# Altium schematic sheet USB.SchDoc
size A4; SheetNumber: 3; SheetTotal: 4
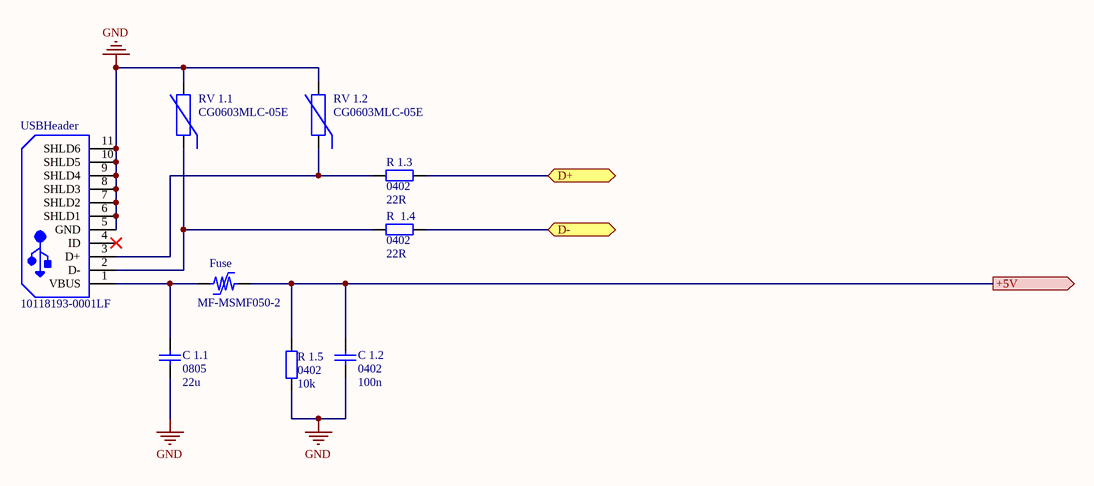
[diagram p0: USB.SchDoc]

## Parts
C_1.1  0805  value 22u  [C0805_M]
C_1.2  0402  value 100n  [C0402_M]
Fuse  MF-MSMF050-2  [BOUR-MF-MSMF050-2_V]
R_1.3  0402  value 22R  [R0402_M]
R_1.4  0402  value 22R  [R0402_M]
R_1.5  0402  value 10k  [R0402_M]
RV_1.1  CG0603MLC-05E  [BOUR-CG0603-2_V]
RV_1.2  CG0603MLC-05E  [BOUR-CG0603-2_V]
USBHeader  10118193-0001LF  [FCI-10118193-0001LF-5_V]

## Ports
+5V (out), D+ (bidir), D- (bidir)

## Nets
GND: C_1.1.1 C_1.2.1 R_1.5.1 RV_1.1.2 RV_1.2.2 USBHeader.5(GND) USBHeader.6(SHLD1) USBHeader.7(SHLD2) USBHeader.8(SHLD3) USBHeader.9(SHLD4) USBHeader.10(SHLD5) USBHeader.11(SHLD6)
+5V: C_1.2.2 Fuse.2 R_1.5.2 ; port +5V
D+: R_1.3.2 ; port D+
D-: R_1.4.2 ; port D-
NetC_1.1_2: C_1.1.2 Fuse.1 USBHeader.1(VBUS)
NetR_1.3_1: R_1.3.1 RV_1.2.1 USBHeader.3(D+)
NetR_1.4_1: R_1.4.1 RV_1.1.1 USBHeader.2(D-)

Not connected (* = marked no-connect by the designer): USBHeader 4(ID)*

## Library data of the parts
C_1.1 = C0805_X5R_22u_20%: Capacitor; Manufactor: Walsin; ManufactorPartNumber: 0805X226M6R3CT; Tech: MLCC X5R; VoltageRating: 6.3V; TempRating: -55°C to +125°C; Tolerance: 20%; Part Number: C0805_X5R_22u_20%; Type: Capacitor; Supplier 1: Farnell; Supplier Part Number 1: 2497053
C_1.2 = C0402_X7R_100n_10%: Capacitor; Manufactor: Yageo; ManufactorPartNumber: CC0402KRX7R7BB104; Tech: MLCC X7R; VoltageRating: 16V; TempRating: -55°C to +125°C; Tolerance: 10%; Part Number: C0402_X7R_100n_10%; Type: Capacitor; Supplier 1: Farnell; Supplier Part Number 1: 9402047
Fuse = CMP-2100-03653-1: PTC Resettable Fuse, 15 V, 500 mA, -40 to 85 degC, 2-Pin SMD, RoHS, Tape and Reel; Manufacturer: Bourns; Voltage Rating (DC): 15V; Max Current Rating: 100A; Power Dissipation: 800mW; Resistance: 150mOhm; Width: 3.41mm; Package Quantity: 2000; Voltage Rating: 15V; RoHSCompliant: true; Contact Plating: Gold; REACH SVHC: NoSVHC; Datasheet URL: http://www.bourns.com/docs/Product-Datasheets/mfmsmf.pdf; Lead Free: LeadFree; Height: 0.85mm; Min Operating Temperature: -40degC; Case Code (Metric): 4532; Number of Terminals: 2; Case Code (Imperial): 1812; Case/Package: 1812; Current Rating: 100A; Length: 4.73mm; Max Operating Temperature: 85degC; Package Reference: MF-MSMF050-2; Radiation Hardening: No; Datasheet Version: Rev. AG, 08/2016; Packaging: TapeandReel; Termination: SMD/SMT; Supply Voltage: 15V; Manufacturer URL: http://www.bourns.com/; Mount: SurfaceMount; Package Description: 2-Pin Surface Mount Device, Body 4.55 x 3.24 mm
R_1.3 R_1.4 = R0402_1%_220R: Resistor; Manufactor: Vishay; ManufactorPartNumber: CRCW0402220RFKEDHP; Tech: Dickschicht; VoltageRating: 50V; PowerRating: 0,125W; Tolerance: 1%; Part Number: R0402_1%_220R; Type: Resistor
R_1.5 = R0402_1%_10k: Resistor; Manufactor: Vishay; ManufactorPartNumber: CRCW040210K0FKEDHP; Tech: Dickschicht; VoltageRating: 50V; PowerRating: 0,125W; Tolerance: 1%; Part Number: R0402_1%_10k; Type: Resistor; Supplier 1: Digi-Key; Supplier Part Number 1: 541-10.0KYCT-ND; Supplier 2: Farnell; Supplier Part Number 2: 1738864
RV_1.1 RV_1.2 = CMP-0584-00001-2: ESD Protector, 5 V Supply, -40 to 85 degC, 1.6 x 0.8 x 0.55 mm SMD, RoHS, Tape and Reel; Manufacturer: Bourns; VC: 20 V; VT: 150 V; RT: 1 ns; VDC: 5 V; CO: 0.5 pF; PartNumber: CG0603MLC-05E; ComponentLink1Description: Manufacturer URL; ComponentLink1URL: http://www.bourns.com/; Packing: Tape and Reel; Mounting Technology: Surface Mount; ComponentLink2Description: Datasheet; RoHS: TRUE; Operating Temperature: -40 to 85 degC; DatasheetVersion: Rev. S; PackageDescription: 2-Pin SMD, Body 1.6 x 0.8 mm, Pitch 1.52 mm; PackageReference: CG0603-2; ComponentLink2URL: http://www.bourns.com/data/global/pdfs/MLC.pdf
USBHeader = CMP-2000-05119-1: Micro USB B Type Receptacle, -55 to 85 degC, 5-Pin SMD, RoHS, Tape and Reel; Manufacturer: FCI; Insulation Resistance: 1000MOhms; Gender: Female; Current Rating: 1.8A; Number of Contacts: 5Contact; Connector Type: MicroUSBTypeBreceptacle; Mounting Angle: Right; Datasheet Version: Rev. C, 05/2015; Packaging: Reel; Product Category: USBConnectors; Standard: USB2.0; Factory Pack Quantity: 1200; Operating Temperature Range: -55Cto+85C; Termination Style: SMD/SMT; Datasheet URL: http://datasheet.octopart.com/10118193-0001LF-FCI-datasheet-55953155.pdf; Contact Material: CopperAlloy; RoHS: Details; Contact Plating: Gold; Flammability Rating: UL94V-0; Manufacturer URL: http://www.fci.com/; Brand: FCI; Product: MicroUSBTypeBConnectors; Color: Black